# EAGLE design Keyglove Kit v0.4 (EAGLE 6.1)
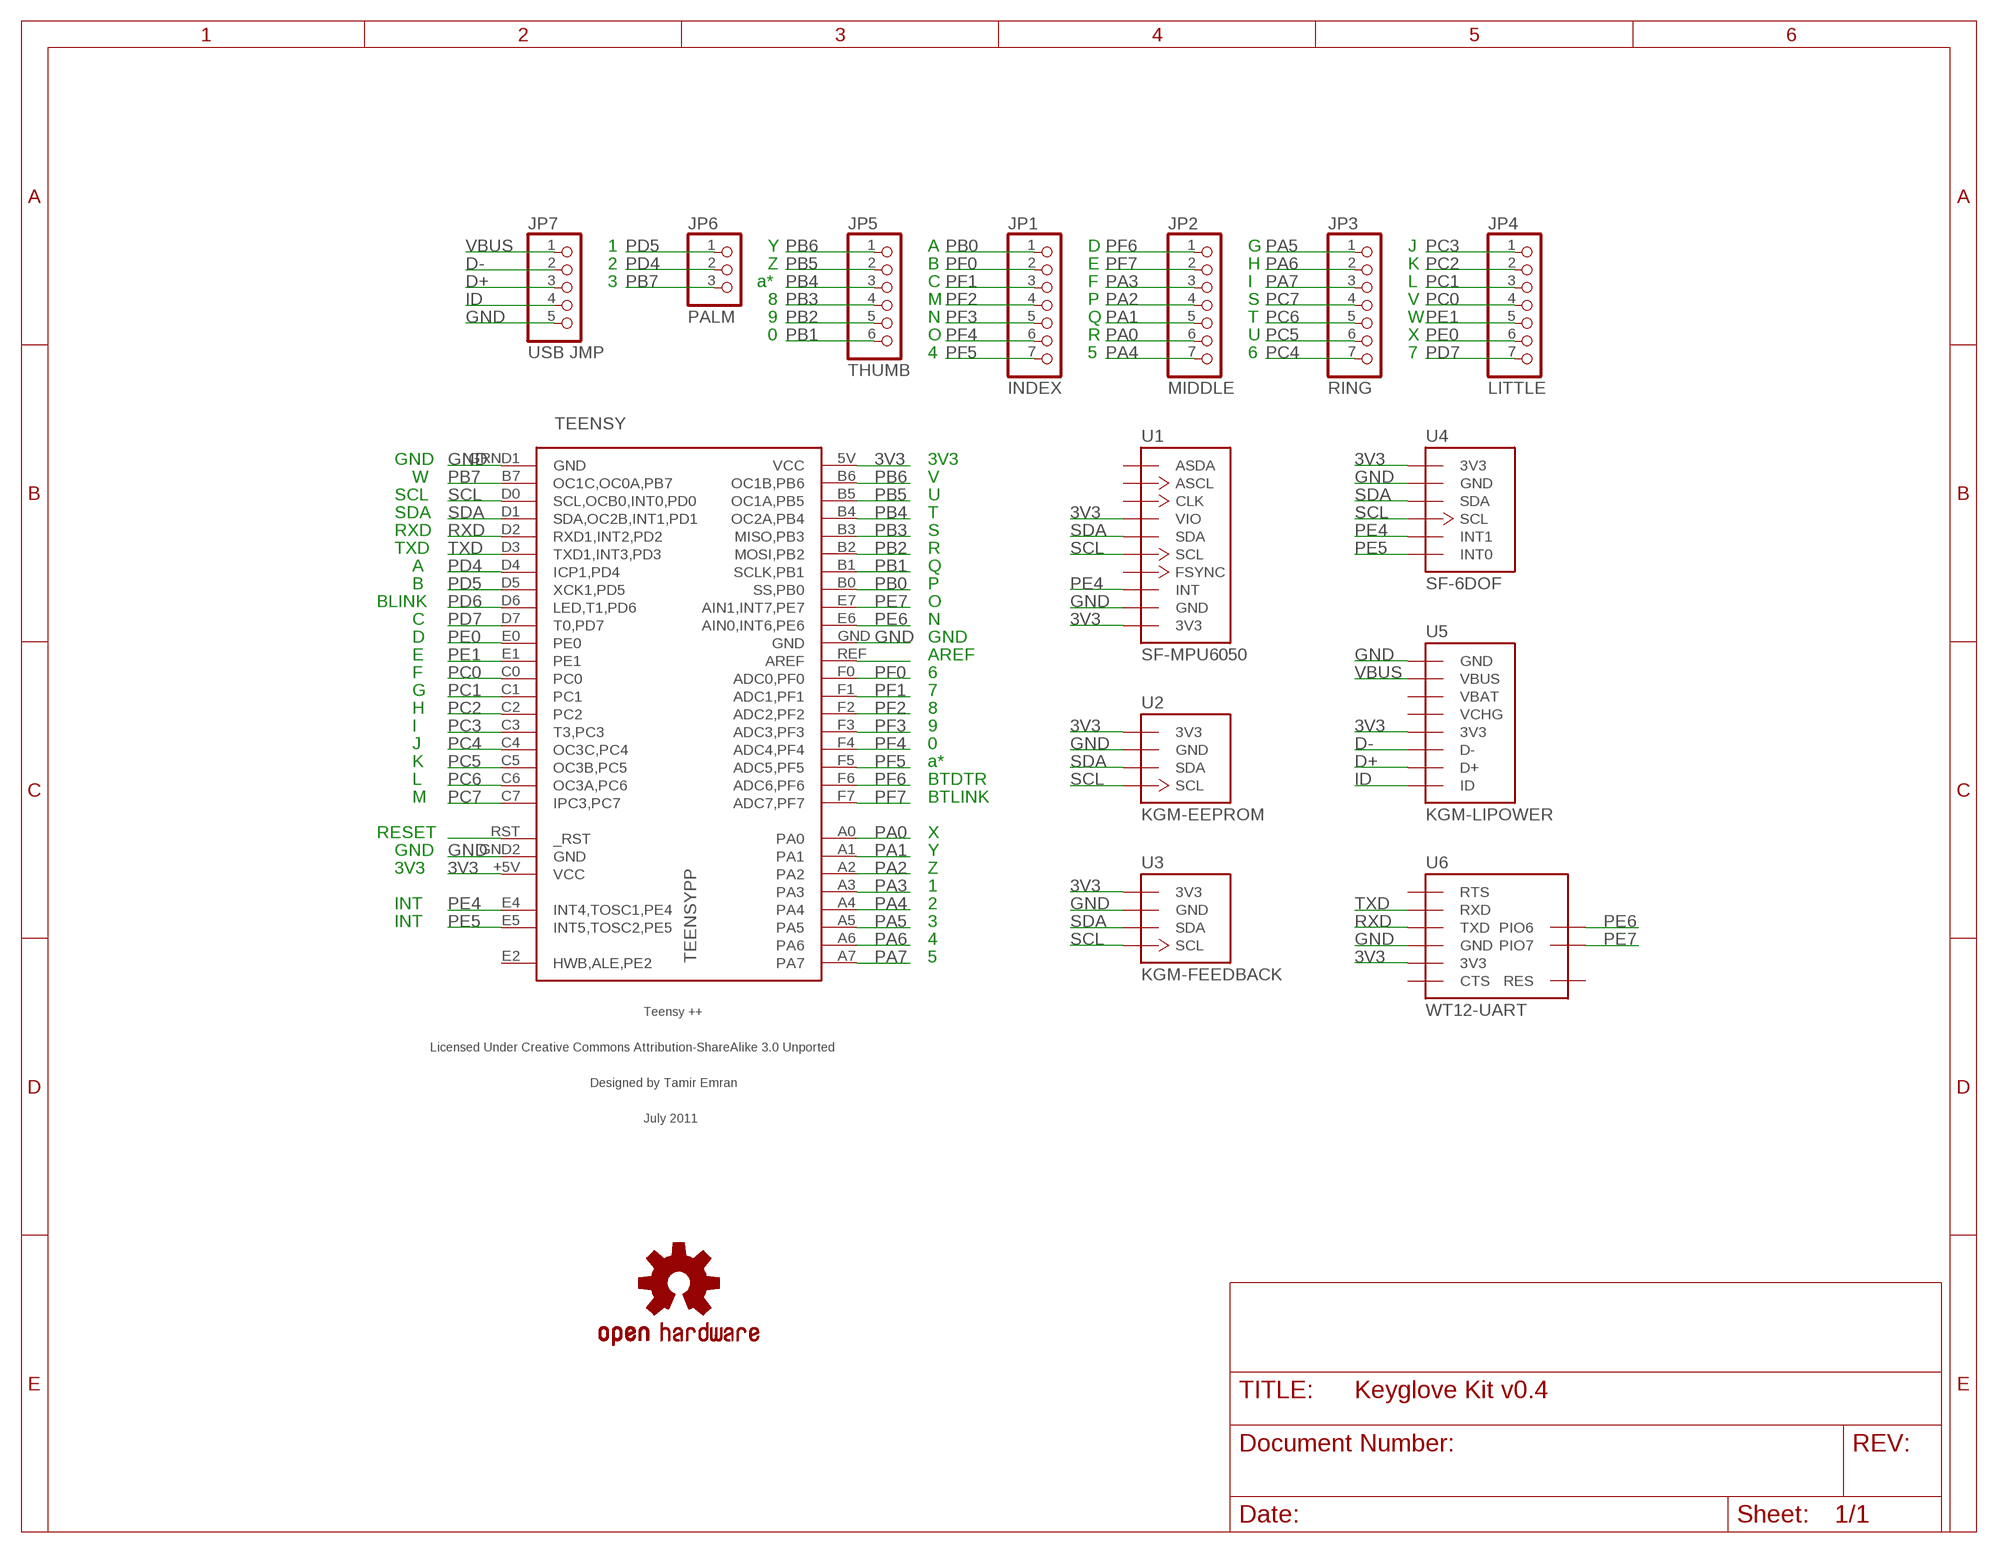
[diagram p0: schematic, sheet 1]

## Parts
JP1  INDEX  PINHD-1X7  [1X07]
JP2  MIDDLE  PINHD-1X7  [1X07]
JP3  RING  PINHD-1X7  [1X07]
JP4  LITTLE  PINHD-1X7  [1X07]
JP5  THUMB  PINHD-1X6  [1X06]
JP6  PALM  PINHD-1X3  [1X03]
JP7  USB JMP  PINHD-1X5  [1X05]
TEENSY  TEENSYPP  [TEENSYPP]
U1  SF-MPU6050  [SF-MPU6050]
U2  KGM-EEPROM  [KGM-EEPROM]
U3  KGM-FEEDBACK  [KGM-FEEDBACK]
U4  SF-6DOF  [SF-6DOF]
U5  KGM-LIPOWER  [KGM-LIPOWER]
U6  WT12-UART  [WT12-UART]
U$1  OSHW-LOGOM  [OSHW-LOGO-M]

## Nets
3V3 [power]: TEENSY.5V(VCC) TEENSY.+5V(VCC) U1.3V3 U1.VIO U2.3V3 U3.3V3 U4.3V3 U5.3V3 U6.3V3
D+: JP7.3 U5.D+
D-: JP7.2 U5.D-
GND [power]: JP7.5 TEENSY.GND TEENSY.GND2(GND) TEENSY.GRND1(GND) U1.GND U2.GND U3.GND U4.GND U5.GND U6.GND
ID: JP7.4 U5.ID
N$107: TEENSY.RST(_RST)
N$128: TEENSY.REF(AREF)
PA0: JP2.6 TEENSY.A0
PA1: JP2.5 TEENSY.A1
PA2: JP2.4 TEENSY.A2
PA3: JP2.3 TEENSY.A3
PA4: JP2.7 TEENSY.A4
PA5: JP3.1 TEENSY.A5
PA6: JP3.2 TEENSY.A6
PA7: JP3.3 TEENSY.A7
PB0: JP1.1 TEENSY.B0(SS,PB0)
PB1: JP5.6 TEENSY.B1(SCLK,PB1)
PB2: JP5.5 TEENSY.B2(MOSI,PB2)
PB3: JP5.4 TEENSY.B3(MISO,PB3)
PB4: JP5.3 TEENSY.B4(OC2A,PB4)
PB5: JP5.2 TEENSY.B5(OC1A,PB5)
PB6: JP5.1 TEENSY.B6(OC1B,PB6)
PB7: JP6.3 TEENSY.B7(OC1C,OC0A,PB7)
PC0: JP4.4 TEENSY.C0
PC1: JP4.3 TEENSY.C1
PC2: JP4.2 TEENSY.C2
PC3: JP4.1 TEENSY.C3(T3,PC3)
PC4: JP3.7 TEENSY.C4(OC3C,PC4)
PC5: JP3.6 TEENSY.C5(OC3B,PC5)
PC6: JP3.5 TEENSY.C6(OC3A,PC6)
PC7: JP3.4 TEENSY.C7(IPC3,PC7)
PD4: JP6.2 TEENSY.D4(ICP1,PD4)
PD5: JP6.1 TEENSY.D5(XCK1,PD5)
PD6: TEENSY.D6(LED,T1,PD6)
PD7: JP4.7 TEENSY.D7(T0,PD7)
PE0: JP4.6 TEENSY.E0
PE1: JP4.5 TEENSY.E1
PE4: TEENSY.E4(INT4,TOSC1,PE4) U1.INT U4.INT1
PE5: TEENSY.E5(INT5,TOSC2,PE5) U4.INT0
PE6: TEENSY.E6(AIN0,INT6,PE6) U6.PIO6
PE7: TEENSY.E7(AIN1,INT7,PE7) U6.PIO7
PF0: JP1.2 TEENSY.F0(ADC0,PF0)
PF1: JP1.3 TEENSY.F1(ADC1,PF1)
PF2: JP1.4 TEENSY.F2(ADC2,PF2)
PF3: JP1.5 TEENSY.F3(ADC3,PF3)
PF4: JP1.6 TEENSY.F4(ADC4,PF4)
PF5: JP1.7 TEENSY.F5(ADC5,PF5)
PF6: JP2.1 TEENSY.F6(ADC6,PF6)
PF7: JP2.2 TEENSY.F7(ADC7,PF7)
RXD: TEENSY.D2(RXD1,INT2,PD2) U6.TXD
SCL: TEENSY.D0(SCL,OCB0,INT0,PD0) U1.SCL U2.SCL U3.SCL U4.SCL
SDA: TEENSY.D1(SDA,OC2B,INT1,PD1) U1.SDA U2.SDA U3.SDA U4.SDA
TXD: TEENSY.D3(TXD1,INT3,PD3) U6.RXD
VBUS [power]: JP7.1 U5.VBUS
Unconnected: TEENSY.E2(HWB,ALE,PE2) U1.ASCL U1.ASDA U1.CLK U1.FSYNC U6.CTS U6.RESET(RES) U6.RTS

## Notes on the sheet
- 1 | Y | A | D | G | J
- 2 | Z | B | E | H | K
- 3 | a* | C | F | I | L
- 8 | M | P | S | V
- 9 | N | Q | T | W
- 0 | O | R | U | X
- 4 | 5 | 6 | 7
- GND | 3V3
- W | V
- SCL | U
- SDA | T
- RXD | S
- TXD | R
- A | Q
- B | P
- BLINK | O
- C | N
- D | GND
- E | AREF
- F | 6
- G | 7
- H | 8
- I | 9
- J | 0
- K | a*
- L | BTDTR
- M | BTLINK
- RESET | X
- GND | Y
- 3V3 | Z
- 1
- INT | 2
- INT | 3
- 4
- 5

## Power pins joined to a net without a drawn wire
VBAT: U5.VBAT
VCHG: U5.VCHG

## Library data of the parts
JP1-JP4 = sf-pinhead:PINHD-1X7: PIN HEADER
JP5 = sf-pinhead:PINHD-1X6: PIN HEADER
JP6 = sf-pinhead:PINHD-1X3: PIN HEADER
JP7 = sf-pinhead:PINHD-1X5: PIN HEADER
TEENSY = sf-keyglovekit:TEENSYPP: Teensy++ Teensy++ board by PJRC <http://www.pjrc.com/>. Eagle part designed by Tamir Emran, July 2011. Licensed under Create Commons Attribution-ShareAlike 3.0 Unported license (CC-BY-SA-3.0).
U1 = sf-keyglovekit:SF-MPU6050
U2 = sf-keyglovekit:KGM-EEPROM
U3 = sf-keyglovekit:KGM-FEEDBACK
U4 = sf-keyglovekit:SF-6DOF
U5 = sf-keyglovekit:KGM-LIPOWER
U6 = sf-keyglovekit:WT12-UART
U$1 = SparkFun:OSHW-LOGO: Open Source Hardware Logo This logo indicates the piece of hardware it is found on incorporates a OSHW license and/or adheres to the definition of open source hardware found here: http://freedomdefined.org/OSHW

## Net classes
0 default: width 0.152 mm, drill 0.33 mm, clearance 0.152 mm
1 power: width 0.203 mm, drill 0.33 mm, clearance 0.152 mm

## Board
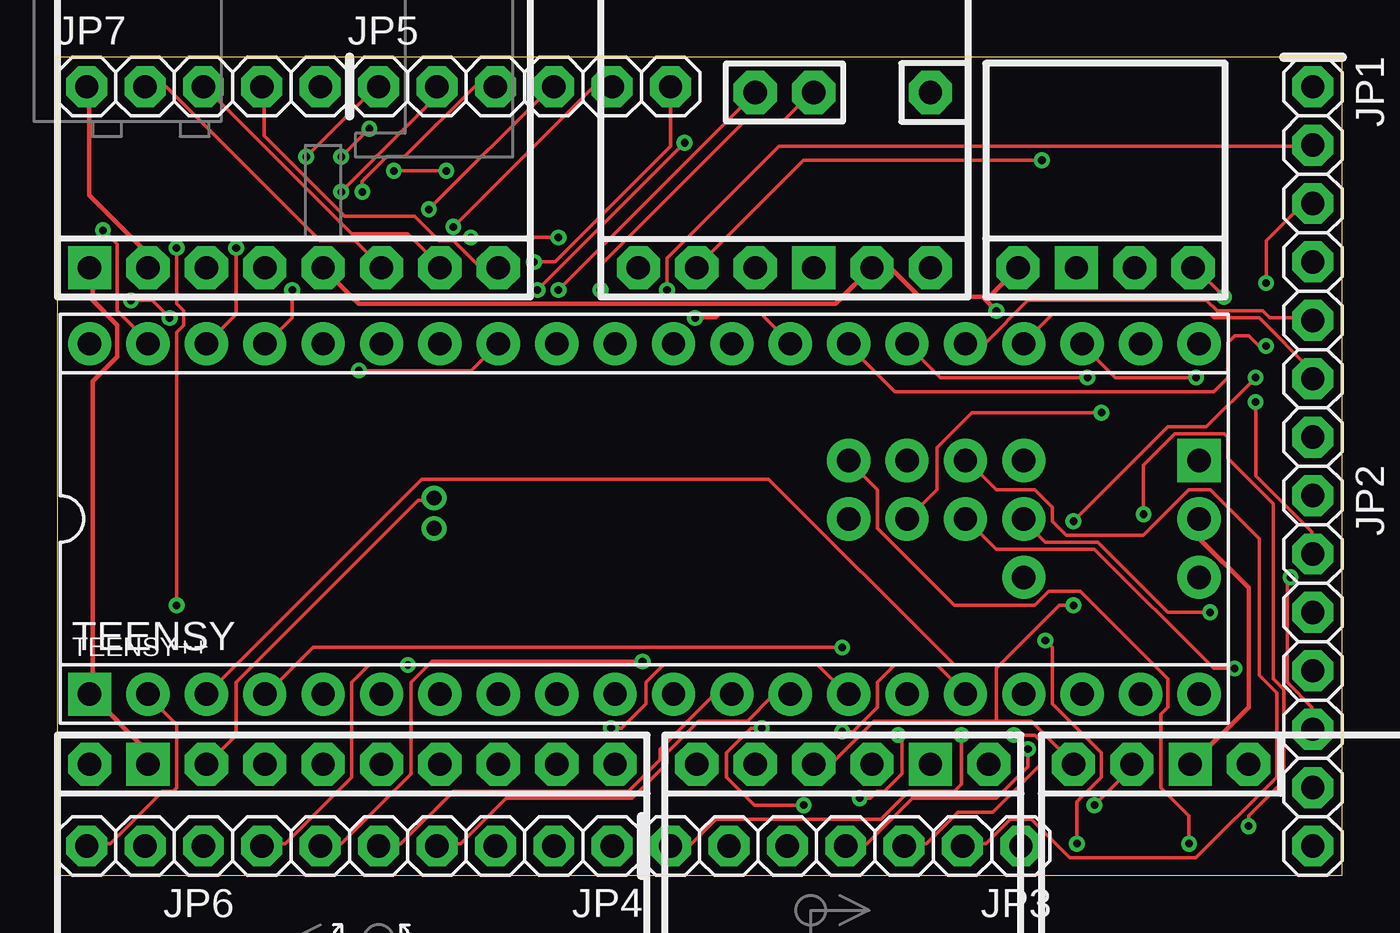
[diagram p1: board, top side]
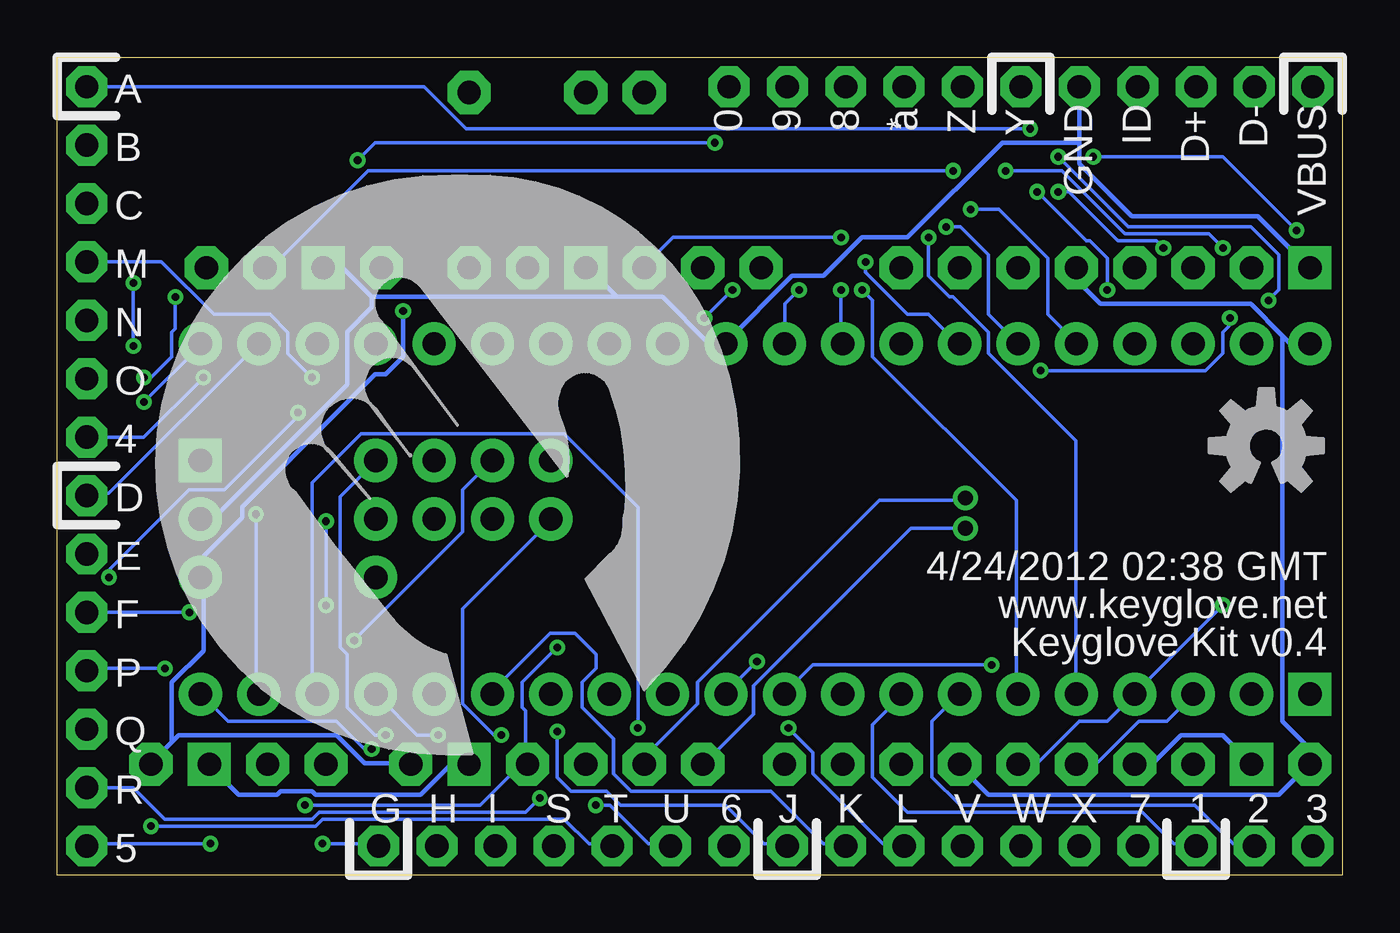
[diagram p2: board, bottom side, seen from below]

Size 55.88 x 35.56 mm. Coordinates in mm from the lower left corner, seen from the top.
Outline: 0,35.56 0,0 55.88,0 55.88,35.56 0,35.56
Copper layers (1*16): Top 0.0356mm / dielectric 1.5011mm / Bottom 0.0356mm
Design rules: minimum track width 6mil, minimum drill 13mil, track to track 6mil, track to pad 6mil, pad to pad 6mil, via to via 6mil, smd to smd 6mil, copper to edge 15mil, drill to drill 6mil, minimum pad ring 7mil, minimum via ring 7mil, stop-mask expansion 4mil, vias tented up to drill 20mil, thermal gap 10mil

### Footprints (pad centres in the part's own frame; a part is rotated, then mirrored left to right if it is on the bottom)
1X07 = drill 1.016 pad 1.778 octagon: 1 -7.62,0; 2 -5.08,0; 3 -2.54,0; 4 0,0; 5 2.54,0; 6 5.08,0; 7 7.62,0
1X06 = drill 1.016 pad 1.778 octagon: 1 -6.35,0; 2 -3.81,0; 3 -1.27,0; 4 1.27,0; 5 3.81,0; 6 6.35,0
1X03 = drill 1.016 pad 1.778 octagon: 1 -2.54,0; 2 0,0; 3 2.54,0
1X05 = drill 1.016 pad 1.778 octagon: 1 -5.08,0; 2 -2.54,0; 3 0,0; 4 2.54,0; 5 5.08,0
TEENSYPP = drill 1.016 pad 1.88: 5V 24.13,-2.54; +5V -24.13,7.62; A0 8.89,0; A1 11.43,0; A2 13.97,0; A3 16.51,0; A4 8.89,2.54; A5 11.43,2.54; A6 13.97,2.54; A7 16.51,2.54; B0 -6.35,7.62; B1 -8.89,7.62; B2 -11.43,7.62; B3 -13.97,7.62; B4 -16.51,7.62; B5 -19.05,7.62; B6 -21.59,7.62; B7 -21.59,-7.62; C0 6.35,-7.62; C1 8.89,-7.62; C2 11.43,-7.62; C3 13.97,-7.62; C4 16.51,-7.62; C5 19.05,-7.62; C6 21.59,-7.62; C7 24.13,-7.62; D0 -19.05,-7.62; D1 -16.51,-7.62; D2 -13.97,-7.62; D3 -11.43,-7.62; D4 -8.89,-7.62; D5 -6.35,-7.62; D6 -3.81,-7.62; D7 -1.27,-7.62; E0 1.27,-7.62; E1 3.81,-7.62; E2 16.51,-2.54; E6 -1.27,7.62; E7 -3.81,7.62; F0 6.35,7.62; F1 8.89,7.62; F2 11.43,7.62; F3 13.97,7.62; F4 16.51,7.62; F5 19.05,7.62; F6 21.59,7.62; F7 24.13,7.62; GND2 24.13,0; GRND1 1.27,7.62; REF 3.81,7.62 | drill 0.635 pad 1.067: E4 -9.144,0.914; E5 -9.144,-0.406 | drill 1.016 pad 1.88 square: GND -24.13,-7.62; RST 24.13,2.54
SF-MPU6050 = drill 1.016 pad 1.88 octagon: 3V3 1.27,1.397; ASCL 1.27,21.717; ASDA 1.27,24.257; CLK 1.27,19.177; FSYNC 1.27,9.017; INT 1.27,6.477; SCL 1.27,11.557; SDA 1.27,14.097; VIO 1.27,16.637 | drill 1.016 pad 1.88 square: GND 1.27,3.937
KGM-EEPROM = drill 1.016 pad 1.88 octagon: 3V3 1.27,9.017; SCL 1.27,1.397; SDA 1.27,3.937 | drill 1.016 pad 1.88 square: GND 1.27,6.477
KGM-FEEDBACK = drill 1.016 pad 1.88 octagon: 3V3 1.27,9.017; SCL 1.27,1.397; SDA 1.27,3.937 | drill 1.016 pad 1.88 square: GND 1.27,6.477
SF-6DOF = drill 1.016 pad 1.88 octagon: 3V3 1.27,14.097; INT0 1.27,1.397; INT1 1.27,3.937; SCL 1.27,6.477; SDA 1.27,9.017 | drill 1.016 pad 1.88 square: GND 1.27,11.557
KGM-LIPOWER = drill 1.016 pad 1.88 octagon: 3V3 1.27,9.017; D+ 1.27,3.937; D- 1.27,6.477; ID 1.27,1.397; VBAT 1.27,14.097; VBUS 1.27,16.637; VCHG 1.27,11.557 | drill 1.016 pad 1.88 square: GND 1.27,19.177
WT12-UART = drill 1.016 pad 1.88 octagon: 3V3 1.27,4.191; CTS 1.27,1.651; PIO6 8.89,6.731; PIO7 8.89,9.271; RESET 8.89,1.651; RTS 1.27,14.351; RXD 1.27,11.811; TXD 1.27,9.271 | drill 1.016 pad 1.88 square: GND 1.27,6.731

### Placement (x,y rotation side)
JP1  54.61,26.67 270 top
JP2  54.61,8.89 270 top
JP3  34.29,1.27 180 top
JP4  16.51,1.27 180 top
JP5  20.32,34.29 0 top
JP6  3.81,1.27 180 top
JP7  6.35,34.29 0 top
TEENSY  25.53,15.49 0 top
U1  0,6.1 270 top
U2  50.8,25.15 90 top
U3  42.8,6.1 270 top
U4  26.42,6.1 270 top
U5  20.57,25.15 90 top
U6  39.62,25.15 90 top
U$1  3.3,18.67 0 bottom

### Tracks (layer width: path | path; a pad name or v marks a point on that pad's centre or on a via)
3V3  (via drill 0.33)
  Top 0.203: 51.82,4.88 U3.3V3 | 40.23,25.15 40.54,25.15 41.76,26.36 U2.3V3 | 40.23,25.15 37.49,25.15 36.27,26.36 35.51,26.36 U6.3V3 35.36,26.36 33.83,24.84 13.11,24.84 11.58,26.36 U5.3V3 | 40.23,25.15 v40.84,24.54
  Bottom 0.203: 50.9,5.79 51.82,4.88 U3.3V3 | 50.9,5.79 50.6,6.1 43.74,6.1 42.52,4.88 40.54,4.88 U4.3V3 | 49.53,12.95 49.53,9.75 50.9,8.38 50.9,5.79 | U1.VIO 16.61,4.72 15.39,3.5 2.74,3.5 1.52,4.72 U1.3V3 1.52,4.88 1.52,5.64 2.59,6.71 2.59,23.47 | 2.59,23.47 3.96,24.84 10.52,24.84 11.43,25.76 11.43,26.36 U5.3V3 | 2.59,23.47 2.29,23.16 1.52,23.16 TEENSY.+5V | 49.53,12.95 49.53,13.87 47.85,15.54 47.85,16 42.06,21.79 41.6,21.79 40.84,22.55 v40.84,24.54 | 49.53,12.95 TEENSY.5V
D+
  Top 0.152: JP7.3 6.4,34.29 12.8,27.89 15.24,27.89 16.61,26.52 U5.D+
D-
  Top 0.152: JP7.2 4.72,34.29 11.43,27.58 12.95,27.58 14.02,26.52 U5.D-
GND
  Top 0.203: U1.GND 3.81,4.88 3.81,5.49 1.52,7.77 TEENSY.GND 1.52,7.92 1.52,21.49 2.59,22.55 2.59,23.93 1.52,24.99 1.52,26.36 U5.GND | 26.82,23.16 TEENSY.GRND1 | 49.68,15.54 TEENSY.GND2 49.68,15.39 49.68,14.63 51.82,12.5 51.82,7.32 49.38,4.88 U3.GND
  Bottom 0.203: 8.99,4.88 8.23,4.88 7.01,6.1 5.18,6.1 3.96,4.88 U1.GND | 11.43,31.85 11.43,30.94 9.14,28.65 3.66,28.65 1.52,26.52 U5.GND | 11.43,31.85 JP7.5 | 26.82,23.16 27.58,23.16 29.57,25.15 31.55,25.15 | 31.55,25.15 32.77,26.36 U6.GND | 42.22,25.15 43.43,26.36 44.2,26.36 U2.GND | 31.55,25.15 42.22,25.15 | U4.GND 38.1,4.72 38.86,4.72 40.08,3.5 44.65,3.5 44.81,3.66 46.18,3.66 46.33,3.5 48.01,3.5 49.23,4.72 U3.GND | 42.22,25.15 42.22,24.69 43.28,23.62 43.28,21.34 49.07,15.54 49.53,15.54 TEENSY.GND2 | 11.43,31.85 14.78,31.85 18.9,27.74 20.88,27.74 22.55,26.06 23.93,26.06 26.82,23.16 | 26.82,23.16 TEENSY.GRND1
ID
  Top 0.152: JP7.4 8.99,34.29 8.99,32.16 12.5,28.65 15.54,28.65 16.61,27.58 17.22,27.58 18.29,26.52 19.05,26.52 U5.ID
PA0  (via drill 0.33)
  Top 0.152: v34.9,3.35 35.36,3.35 35.66,3.66 35.97,3.66 36.73,4.42 36.73,5.94 v36.58,6.1
  Bottom 0.152: JP2.6 52.58,3.81 51.21,2.44 44.81,2.44 44.5,2.74 35.51,2.74 v34.9,3.35 | v36.58,6.1 36.88,6.1 38.25,7.47 38.25,11.58 34.44,15.39 TEENSY.A0
PA1  (via drill 0.33)
  Top 0.152: v53.65,12.95 53.49,12.8 53.49,8.38 54.56,7.32 54.56,6.4 JP2.5 | v45.41,20.12 39.78,20.12 38.25,18.59 38.25,16.76 37.03,15.54 TEENSY.A1
  Bottom 0.152: v53.65,12.95 53.65,13.26 50.14,16.76 48.62,16.76 45.41,19.96 v45.41,20.12
PA2  (via drill 0.33)
  Top 0.152: v51.21,8.99 50.29,8.99 45.11,14.17 40.84,14.17 39.62,15.39 TEENSY.A2
  Bottom 0.152: v51.21,8.99 54.56,8.99 JP2.4
PA3  (via drill 0.33)
  Top 0.152: v50.14,11.43 48.31,11.43 45.26,14.48 42.98,14.48 42.06,15.39 TEENSY.A3
  Bottom 0.152: v50.14,11.43 JP2.3
PA4  (via drill 0.33)
  Top 0.152: v49.23,1.37 49.23,2.59 48.01,3.81 48.01,7.01 48.31,7.32 48.31,8.53 44.5,12.34 43.13,12.34 42.52,11.73 39.01,11.73 35.66,15.09 35.66,16.76 34.44,17.98 TEENSY.A4
  Bottom 0.152: v49.23,1.37 54.56,1.37 JP2.7
PA5  (via drill 0.33)
  Top 0.152: v44.35,1.37 44.35,3.2 45.41,4.27 45.41,5.33 43.28,7.47 43.28,9.91 v42.98,10.21
  Bottom 0.152: v44.35,1.37 41.91,1.37 JP3.1 | v42.98,10.21 38.25,14.94 38.25,16.76 37.03,17.98 TEENSY.A5
PA6
  Top 0.152: JP3.2 39.47,1.37 40.39,1.37 41.45,2.44 42.37,2.44 44.04,0.76 49.53,0.76 53.03,4.27 53.03,7.92 52.27,8.69 52.27,14.63 50.14,16.76 49.23,16.76 47.24,14.78 43.89,14.78 43.28,15.39 43.28,16 42.52,16.76 40.84,16.76 39.62,17.98 TEENSY.A6
PA7  (via drill 0.33)
  Top 0.152: v41.6,6.1 42.52,6.1 42.82,5.79 42.82,4.88 40.69,2.74 39.17,2.74 37.8,1.37 36.88,1.37 JP3.3
  Bottom 0.152: v41.6,6.1 42.06,6.1 43.28,7.32 43.28,9.6 43.59,9.91 43.59,16.46 42.06,17.98 TEENSY.A7
PB0  (via drill 0.33)
  Top 0.152: v12.34,31.24 v13.56,32.46 | v3.2,24.99 4.12,24.99 v4.88,24.23 | v13.11,21.95 17.98,21.95 19.05,23.01 TEENSY.B0
  Bottom 0.152: JP1.1 39.93,34.29 38.1,32.46 v13.56,32.46 | v12.34,31.24 9.3,28.19 3.96,28.19 2.74,26.98 2.74,25.45 v3.2,24.99 | v4.88,24.23 4.88,23.93 5.18,23.62 5.18,22.71 5.94,21.95 v13.11,21.95
PB1  (via drill 0.33)
  Top 0.152: JP5.6 26.67,31.7 21.64,26.67 v20.73,26.67
  Bottom 0.152: v20.73,26.67 20.73,26.21 18.9,24.38 17.98,24.38 16.76,23.16 TEENSY.B1
PB2  (via drill 0.33)
  Top 0.152: JP5.5 23.32,34.29 v17.22,28.19
  Bottom 0.152: v17.22,28.19 16.61,28.19 15.39,26.98 15.39,24.38 14.17,23.16 TEENSY.B2
PB3  (via drill 0.33)
  Top 0.152: v16.15,28.96 21.49,34.29 JP5.4
  Bottom 0.152: v16.15,28.96 14.94,28.96 12.8,26.82 12.8,24.38 11.58,23.16 TEENSY.B3
PB4  (via drill 0.33)
  Top 0.152: JP5.3 18.14,34.29 15.09,31.24 14.33,31.24 13.26,30.18 v13.26,29.72 | v10.21,25.45 10.21,24.23 9.14,23.16 TEENSY.B4
  Bottom 0.152: v13.26,29.72 11.12,27.58 10.97,27.58 10.21,26.82 v10.21,25.45
PB5  (via drill 0.33)
  Top 0.152: v12.34,29.72 16.46,33.83 16.46,34.29 JP5.2 | v7.77,27.28 7.77,24.38 6.55,23.16 TEENSY.B5
  Bottom 0.152: v12.34,29.72 11.89,29.72 9.75,27.58 8.08,27.58 v7.77,27.28
PB6  (via drill 0.33)
  Top 0.152: v10.82,31.24 13.87,34.29 JP5.1 | v1.98,28.04 2.59,27.43 2.59,24.54 3.96,23.16 TEENSY.B6
  Bottom 0.152: v10.82,31.24 5.18,31.24 v1.98,28.04
PB7
  Top 0.152: JP6.3 1.37,1.37 2.29,1.37 4.57,3.66 5.03,3.66 5.18,3.81 5.18,6.55 3.96,7.77 TEENSY.B7
PC0
  Top 0.152: JP4.4 16.61,1.37 17.53,1.37 19.51,3.35 24.99,3.35 26.52,4.88 26.52,5.33 27.89,6.71 30.02,6.71 31.09,7.77 31.85,7.77 TEENSY.C0
PC1  (via drill 0.33)
  Top 0.152: v24.08,6.4 24.54,6.4 25.6,7.47 25.6,8.38 26.36,9.14 33.07,9.14 34.29,7.92 TEENSY.C1
  Bottom 0.152: v24.08,6.4 23.01,5.33 23.01,4.42 19.96,1.37 19.05,1.37 JP4.3
PC2
  Bottom 0.152: JP4.2 21.64,1.37 22.55,1.37 24.84,3.66 30.94,3.66 31.7,4.42 31.7,5.94 33.07,7.32 33.07,8.38 32.46,8.99 32.46,9.6 33.38,10.52 34.44,10.52 37.03,7.92 TEENSY.C2
PC3  (via drill 0.33)
  Top 0.152: v34.14,6.25 34.59,6.25 35.66,7.32 35.66,8.38 36.42,9.14 38.25,9.14 39.47,7.92 TEENSY.C3
  Bottom 0.152: v34.14,6.25 34.14,4.27 33.53,3.66 32,3.66 31.39,3.05 26.82,3.05 25.15,1.37 24.23,1.37 JP4.1
PC4  (via drill 0.33)
  Top 0.152: v39.32,6.1 39.32,3.96 39.01,3.66 37.03,3.66 35.81,2.44 28.65,2.44 27.58,1.37 26.67,1.37 JP3.7
  Bottom 0.152: v39.32,6.1 40.23,6.1 41.91,7.77 TEENSY.C4
PC5  (via drill 0.33)
  Top 0.152: v32.46,3.05 30.33,3.05 29.11,4.27 29.11,5.33 30.18,6.4 v30.63,6.4
  Bottom 0.152: v32.46,3.05 31.85,3.05 30.18,1.37 29.26,1.37 JP3.6 | v30.63,6.4 30.63,16 33.83,19.2 42.67,19.2 44.81,17.07 44.81,8.08 44.65,7.92 TEENSY.C5
PC6  (via drill 0.33)
  Top 0.152: v51.82,2.13 51.82,2.59 53.34,4.12 53.34,8.08 52.88,8.53 52.88,16.15 50.9,18.14 50.9,19.05 50.75,19.2 48.62,19.2 47.24,17.83 v47.24,15.7
  Bottom 0.152: v51.82,2.13 44.65,2.13 44.35,2.44 33.83,2.44 32.77,1.37 31.85,1.37 JP3.5 | v47.24,15.7 47.24,7.92 TEENSY.C6
PC7  (via drill 0.33)
  Top 0.152: v42.22,5.49 42.22,4.72 40.84,3.35 37.19,3.35 35.2,1.37 34.29,1.37 JP3.4
  Bottom 0.152: v42.22,5.49 42.52,5.49 43.74,6.71 48.46,6.71 49.53,7.77 TEENSY.C7
PD4
  Bottom 0.152: JP6.2 3.81,1.37 4.72,1.37 6.4,3.05 16.61,3.05 17.83,4.27 17.83,6.71 16.76,7.77 TEENSY.D4
PD5
  Bottom 0.152: JP6.1 6.4,1.37 7.32,1.37 8.69,2.74 18.9,2.74 20.42,4.27 20.42,6.55 19.2,7.77 TEENSY.D5
PD7  (via drill 0.33)
  Top 0.152: v15.24,9.14 13.56,9.14 12.8,8.38 12.8,4.27 9.91,1.37 8.99,1.37 JP4.7
  Bottom 0.152: v15.24,9.14 23.01,9.14 24.23,7.92 TEENSY.D7
PE0  (via drill 0.33)
  Top 0.152: v25.45,9.3 16.31,9.3 15.39,8.38 15.39,4.42 12.34,1.37 11.43,1.37 JP4.6
  Bottom 0.152: v25.45,9.3 26.82,7.92 TEENSY.E0
PE1
  Top 0.152: JP4.5 14.02,1.37 14.94,1.37 17.22,3.66 24.84,3.66 26.21,5.03 26.21,5.49 28.5,7.77 29.26,7.77 TEENSY.E1
PE4
  Top 0.152: TEENSY.E4 16.31,16.31 15.7,16.31 7.77,8.38 7.77,6.1 6.55,4.88 U1.INT
  Bottom 0.152: U4.INT1 30.33,4.88 30.33,5.18 28.04,7.47 28.04,8.38 20.12,16.31 16.46,16.31 TEENSY.E4
PE5
  Bottom 0.152: TEENSY.E5 18.75,15.09 25.6,8.23 25.6,7.01 27.74,4.88 U4.INT0
PE6  (via drill 0.33)
  Top 0.152: v23.62,25.45 23.62,26.52 29.87,32.77 31.55,32.77 32.77,33.98 U6.PIO6
  Bottom 0.152: v23.62,25.45 24.23,24.84 24.23,23.16 TEENSY.E6
PE7  (via drill 0.33)
  Top 0.152: v21.79,25.45 30.33,33.98 U6.PIO7
  Bottom 0.152: v21.79,25.45 21.79,23.16 TEENSY.E7
PF0  (via drill 0.33)
  Top 0.152: v26.52,25.45 26.52,26.82 31.39,31.7 54.56,31.7 JP1.2 | v27.74,24.23 28.65,24.23 28.8,24.38 30.63,24.38 31.85,23.16 TEENSY.F0
  Bottom 0.152: v27.74,24.23 v26.52,25.45
PF1  (via drill 0.33)
  Top 0.152: v52.58,25.76 52.58,27.58 54.1,29.11 54.56,29.11 JP1.3 | v52.58,23.01 52.27,23.01 51.82,23.47 51.21,23.47 50.9,23.16 50.9,21.64 50.29,21.03 36.42,21.03 34.44,23.01 TEENSY.F1
  Bottom 0.152: v52.58,23.01 v52.58,25.76
PF2  (via drill 0.33)
  Top 0.152: v44.81,21.64 38.41,21.64 37.03,23.01 TEENSY.F2
  Bottom 0.152: JP1.4 51.36,26.67 49.07,24.38 46.63,24.38 45.87,23.62 45.87,22.71 v44.81,21.64
PF3
  Top 0.152: JP1.5 54.56,24.23 52.73,24.23 52.43,24.54 50.44,24.54 49.99,24.99 42.22,24.99 40.39,23.16 39.62,23.16 TEENSY.F3
PF4
  Top 0.152: JP1.6 54.56,21.64 54.56,21.95 52.27,24.23 50.29,24.23 50.14,24.38 43.28,24.38 42.06,23.16 TEENSY.F4
PF5  (via drill 0.33)
  Top 0.152: v49.53,21.64 46.02,21.64 44.65,23.01 TEENSY.F5
  Bottom 0.152: JP1.7 52.12,19.05 v49.53,21.64
PF6
  Bottom 0.152: JP2.1 54.56,16.61 53.65,16.61 47.24,23.01 TEENSY.F6
PF7  (via drill 0.33)
  Top 0.152: v52.12,20.57 52.12,17.37 54.56,14.94 54.56,14.02 JP2.2
  Bottom 0.152: v52.12,20.57 49.68,23.01 TEENSY.F7
RXD  (via drill 0.33)
  Top 0.152: v21.79,27.74 v17.98,27.74
  Bottom 0.152: v17.98,27.74 17.98,26.06 17.07,25.15 16.92,25.15 15.39,23.62 15.39,22.71 11.58,18.9 11.58,7.92 TEENSY.D2 | v21.79,27.74 29.11,27.74 30.33,26.52 U6.TXD
SCL  (via drill 0.33)
  Top 0.152: 40.84,6.71 42.37,6.71 44.2,4.88 U3.SCL | 40.84,6.71 35.51,6.71 33.68,4.88 32.92,4.88 U4.SCL | v50.75,25.15 49.53,26.36 U2.SCL | v52.12,21.64 49.99,19.51 48.31,19.51 v44.2,15.39 | v44.2,11.73 43.59,11.73 41,9.14 | 41,9.14 40.84,8.99 40.84,6.71 | 41,9.14 39.01,9.14 30.94,17.22 15.85,17.22 6.55,7.92 TEENSY.D0
  Bottom 0.152: U1.SCL 11.43,4.88 10.67,4.88 8.84,6.71 7.62,6.71 6.55,7.77 TEENSY.D0 | v50.75,25.15 50.75,23.77 50.9,23.62 50.9,22.55 51.82,21.64 v52.12,21.64 | v44.2,11.73 v44.2,15.39
SDA  (via drill 0.33)
  Top 0.152: v45.11,3.05 46.79,4.72 U3.SDA | v14.63,30.63 v16.92,30.63 | v5.18,27.28 5.18,24.84 5.49,24.54 5.49,23.93 5.18,23.62 v5.18,11.73 | v34.14,9.91 11.12,9.91 9.14,7.92 TEENSY.D1
  Bottom 0.152: v45.11,3.05 37.49,3.05 35.81,4.72 35.51,4.72 U4.SDA 35.51,4.88 35.51,7.16 35.66,7.32 35.66,8.38 v34.14,9.91 | U1.SDA 14.02,4.88 13.26,4.88 11.43,6.71 10.21,6.71 9.14,7.77 TEENSY.D1 8.99,7.92 v5.18,11.73 | v16.92,30.63 42.37,30.63 46.48,26.52 46.79,26.52 U2.SDA | v14.63,30.63 12.19,30.63 9.45,27.89 5.79,27.89 v5.18,27.28
TXD  (via drill 0.33)
  Top 0.152: v27.28,31.85 v20.88,25.45 | v42.82,31.09 32.46,31.09 27.89,26.52 U6.RXD
  Bottom 0.152: v20.88,25.45 20.42,24.99 20.42,22.55 14.17,16.31 14.17,7.92 TEENSY.D3 | v27.28,31.85 42.06,31.85 v42.82,31.09
VBUS
  Top 0.203: JP7.1 1.37,34.29 1.37,29.57 3.81,27.13 3.81,26.52 U5.VBUS

### Text on the board
tPlace: TEENSY++
bPlace: VBUS | D- | ID | GND | A | D+ | Y | Z | a | 8 | 9 | 0 | * | B | C | M | N | O | 4 | D | 4/24/2012 02:38 GMT | E | www.keyglove.net | Keyglove Kit v0.4 | F | P | Q | R | 3 | 2 | 1 | 7 | X | W | V | L | K | J | 6 | U | T | S | I | H | G | 5